# EAGLE design OPENKAYO-v1_1 (EAGLE 9.7.0)

## Sheet 1 of 3
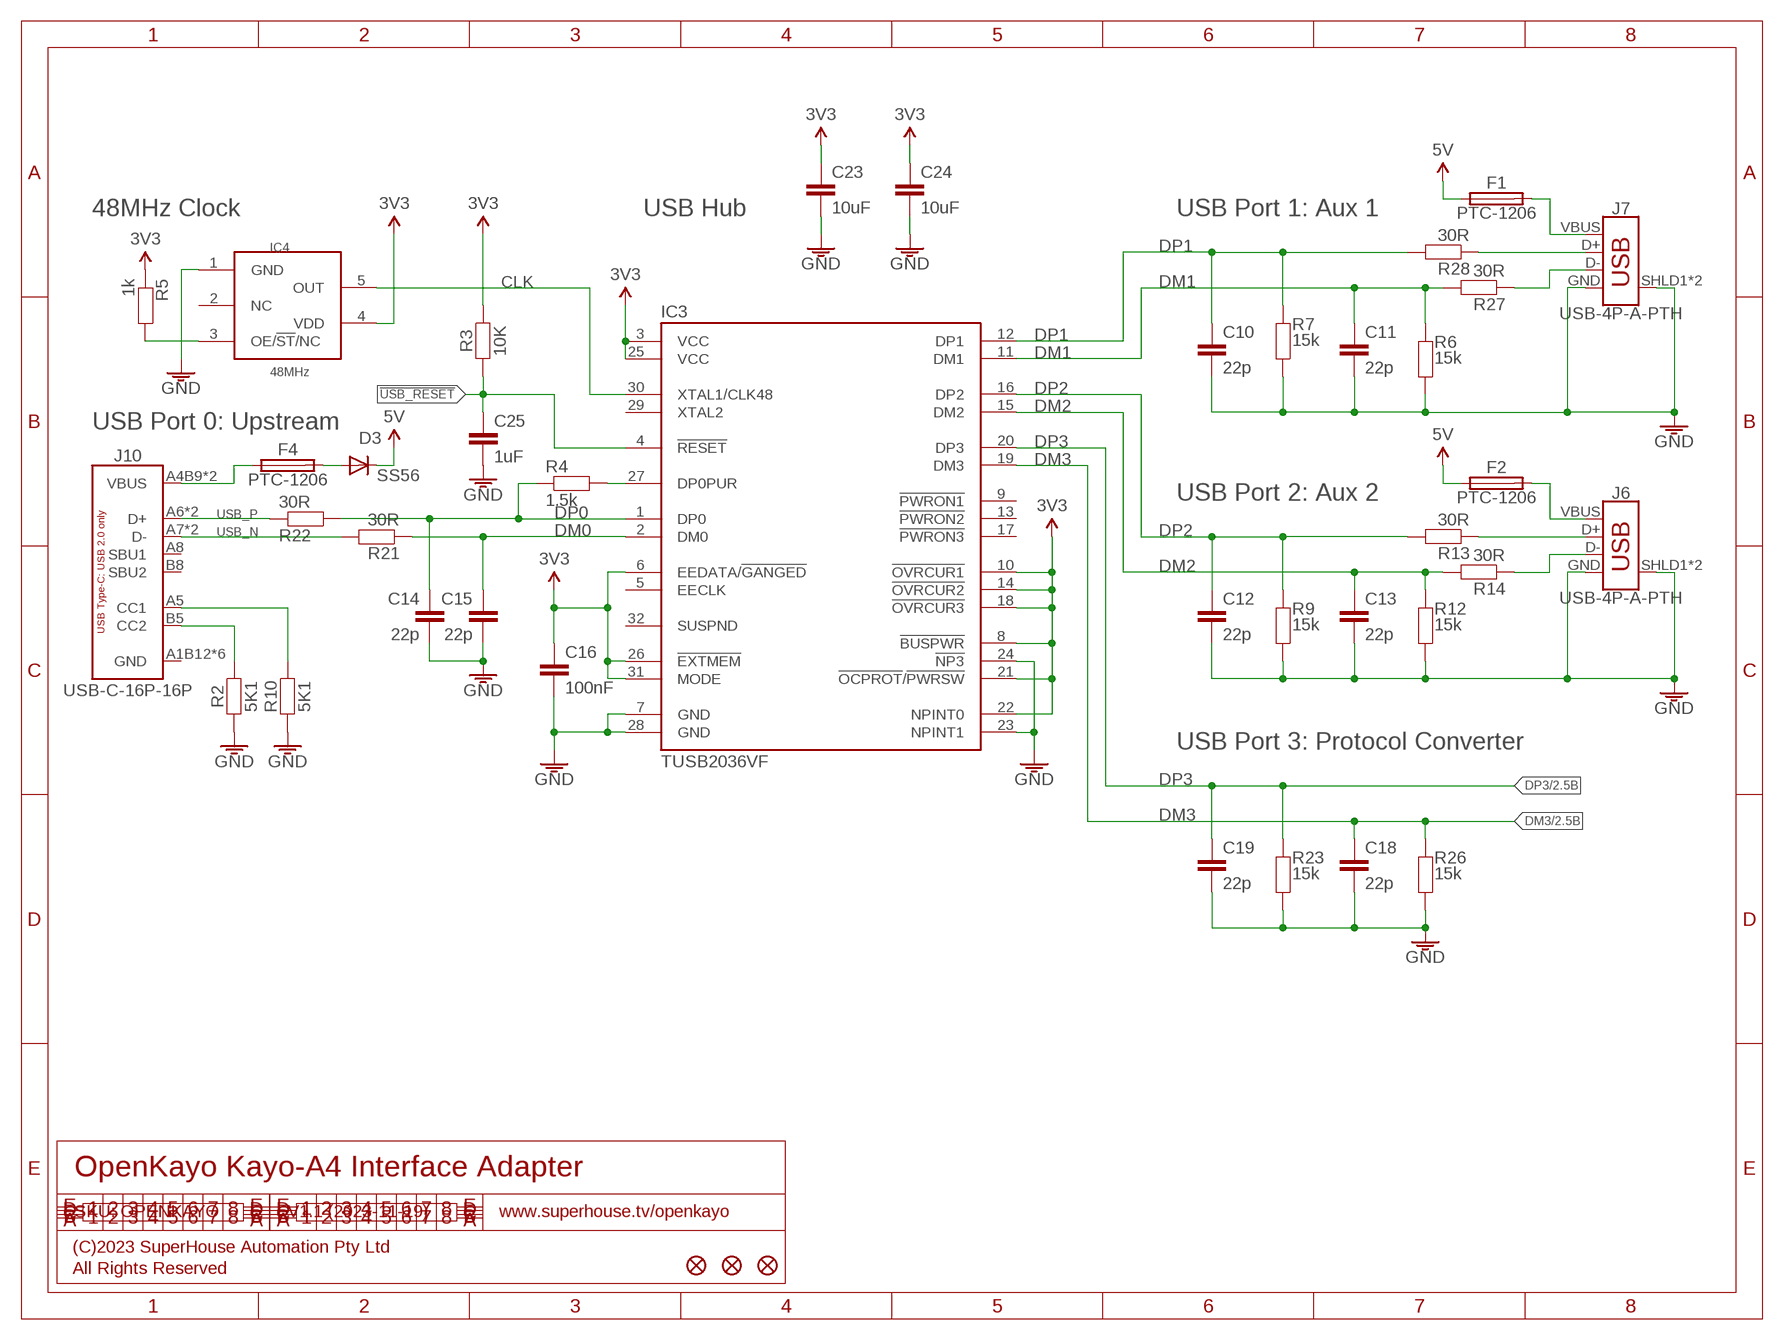
[diagram p0: schematic, sheet 1]

### Parts
C10  22p  CAP0603  [C0603]
C11  22p  CAP0603  [C0603]
C12  22p  CAP0603  [C0603]
C13  22p  CAP0603  [C0603]
C14  22p  CAP0603  [C0603]
C15  22p  CAP0603  [C0603]
C16  100nF  CAP0603  [C0603]
C18  22p  CAP0603  [C0603]
C19  22p  CAP0603  [C0603]
C23  10uF  CAP0805  [C0805]
C24  10uF  CAP0805  [C0805]
C25  1uF  CAP0603  [C0603]
D3  SS56  DIODESMA  [SMA-DIODE]
F1  PTC-1206  [1206]
F2  PTC-1206  [1206]
F4  PTC-1206  [1206]
FID1  FIDUCIAL1X2.5  [FIDUCIAL-1X2.5]
FID2  FIDUCIAL1X2.5  [FIDUCIAL-1X2.5]
FID3  FIDUCIAL1X2.5  [FIDUCIAL-1X2.5]
IC3  TUSB2036VF  [PQFP-G32]
IC4  48MHz  SIT2001BSOT-23-5  [SOT-23-5]
J6  USB-4P-A-PTH  [USB-A-PTH]
J7  USB-4P-A-PTH  [USB-A-PTH]
J10  USB-C-16P-16P  [USB-C-16P]
R2  5K1  RESISTOR0603  [R0603]
R3  10K  RESISTOR0603  [R0603]
R4  1.5k  RESISTOR0603  [R0603]
R5  1k  RESISTOR0603  [R0603]
R6  15k  RESISTOR0603  [R0603]
R7  15k  RESISTOR0603  [R0603]
R9  15k  RESISTOR0603  [R0603]
R10  5K1  RESISTOR0603  [R0603]
R12  15k  RESISTOR0603  [R0603]
R13  30R  RESISTOR0603  [R0603]
R14  30R  RESISTOR0603  [R0603]
R21  30R  RESISTOR0603  [R0603]
R22  30R  RESISTOR0603  [R0603]
R23  15k  RESISTOR0603  [R0603]
R26  15k  RESISTOR0603  [R0603]
R27  30R  RESISTOR0603  [R0603]
R28  30R  RESISTOR0603  [R0603]

### Nets
3.3V: C16.1 C23.1 C24.1 IC3.3(VCC) IC3.6(EEDATA/!GANGED) IC3.8(!BUSPWR) IC3.10(!OVRCUR1) IC3.14(!OVRCUR2) IC3.18(!OVRCUR3) IC3.21(!OCPROT!/!PWRSW!) IC3.22(NPINT0) IC3.25(VCC) IC3.26(!EXTMEM) IC3.31(MODE) IC4.4(VDD) R3.2 R5.1 ; also sheet 2,3
5V: D3.C F1.1 F2.1 ; also sheet 2,3
!USB_RESET: C25.1 IC3.4(!RESET) R3.1
CLK: IC3.30(XTAL1/CLK48) IC4.5(OUT)
DM0: C15.1 IC3.2(DM0) R21.2
DM1: C11.1 IC3.11(DM1) R6.1 R27.2
DM2: C13.1 IC3.15(DM2) R12.1 R14.2
DM3: C18.1 IC3.19(DM3) R26.1 ; also sheet 2
DP0: C14.1 IC3.1(DP0) R4.1 R22.2
DP1: C10.1 IC3.12(DP1) R7.1 R28.2
DP2: C12.1 IC3.16(DP2) R9.1 R13.2
DP3: C19.1 IC3.20(DP3) R23.1 ; also sheet 2
GND: C10.2 C11.2 C12.2 C13.2 C14.2 C15.2 C16.2 C18.2 C19.2 C23.2 C24.2 C25.2 IC3.7(GND) IC3.23(NPINT1) IC3.24(!NP3) IC3.28(GND) IC4.1(GND) J6.GND J6.SHLD1(SHIELD) J6.SHLD2(SHIELD) J7.GND J7.SHLD1(SHIELD) J7.SHLD2(SHIELD) R2.1 R6.2 R7.2 R9.2 R10.1 R12.2 R23.2 R26.2 ; also sheet 2,3
N$1: IC3.27(DP0PUR) R4.2
N$2: IC4.3(OE/!ST!/NC) R5.2
N$5: F1.2 J7.VBUS
N$6: F2.2 J6.VBUS
N$7: J10.B5(CC2) R2.2
N$12: J10.A5(CC1) R10.2
N$14: J6.D+ R13.1
N$15: J6.D- R14.1
N$16: J7.D+ R28.1
N$17: J7.D- R27.1
N$22: F4.1 J10.A4B9(VBUS) J10.A9B4(VBUS)
N$24: D3.A F4.2
USB_N: J10.A7(D-) J10.B7(D-) R21.1
USB_P: J10.A6(D+) J10.B6(D+) R22.1
Unconnected: IC3.5(EECLK) IC3.9(!PWRON1) IC3.13(!PWRON2) IC3.17(!PWRON3) IC3.29(XTAL2) IC3.32(SUSPND) IC4.2(NC) J10.A8(SBU1) J10.B8(SBU2)

### Notes on the sheet
- 48MHz Clock | USB Hub | USB Port 1: Aux 1
- USB Port 0: Upstream
- USB Port 2: Aux 2
- USB Port 3: Protocol Converter
- OpenKayo Kayo-A4 Interface Adapter
- SKU: OPENKAYO | V1.1 (2023-11-19) | www.superhouse.tv/openkayo
- (C)2023 SuperHouse Automation Pty Ltd
- All Rights Reserved

## Sheet 2 of 3
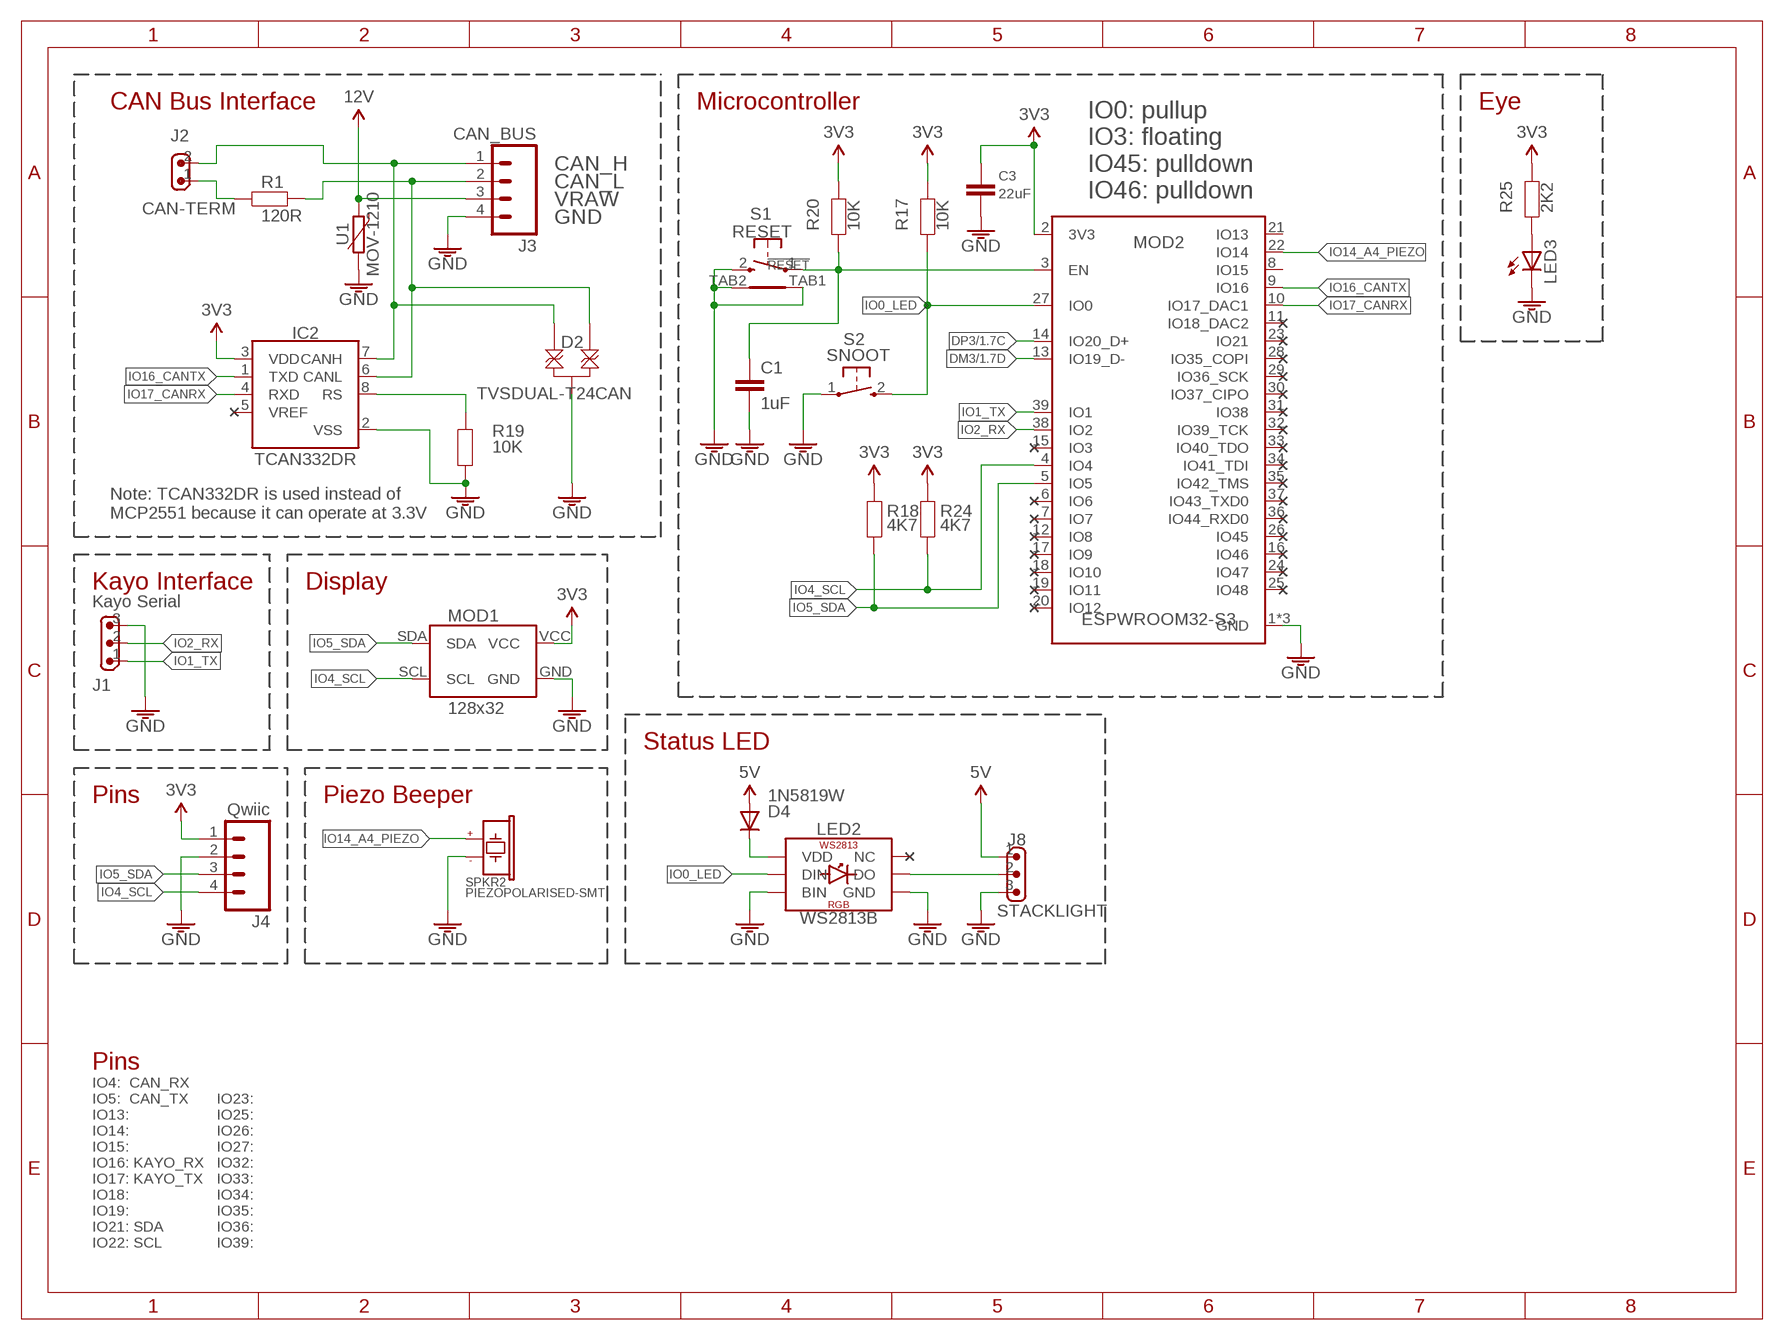
[diagram p1: schematic, sheet 2]

### Parts
C1  1uF  CAP0603  [C0603]
C3  22uF  CAP0805  [C0805]
D2  TVSDUAL-T24CAN  [SOT23-3]
D4  1N5819W  DIODE-SOD123  [SOD-123]
IC2  TCAN332DR  MCP2551-SOIC8  [SOIC8]
J1  Kayo Serial  M03-SCREW-3.81MM-HOR  [SCREWTERMINAL-3.81MM-HOR-3]
J2  CAN-TERM  M02-PIN-JUMP-Y  [1X02-P-JUMP-Y]
J3  CAN_BUS  M04-SCREW-3.81MM-HOR-PLUG  [SCREWTERMINAL-3.81MM-HOR-4]
J4  Qwiic  M04-SM4B-SH  [JST-SM4B-SH]
J8  STACKLIGHT  M03-PLAIN  [1X03]
LED2  WS2813B  WS2813-5050  [WS2813]
LED3  LED0603  [LED-0603]
MOD1  128x32  OLED-I2C-128X32-0.91-HEADER  [OLED-128X32-0.91-HEADER]
MOD2  ESPWROOM32-S3  [ESPWROOM32-S3]
R1  120R  RESISTOR2010  [R2010]
R17  10K  RESISTOR0603  [R0603]
R18  4K7  RESISTOR0603  [R0603]
R19  10K  RESISTOR0603  [R0603]
R20  10K  RESISTOR0603  [R0603]
R24  4K7  RESISTOR0603  [R0603]
R25  2K2  RESISTOR0603  [R0603]
S1  RESET  TAC-SWITCH-2PIN-GND-FSMRAJ  [TYCO-FSMRAJ]
S2  SNOOT  TAC_SWITCH_2PINSMT  [TACTILE_SMT_3X4X2]
SPKR2  PIEZOPOLARISED-SMT  [PIEZO-9.6X9.6-SMT]
U1  MOV-1210  [1210]

### Nets
3.3V: C3.1 IC2.3(VDD) J4.1 MOD1.VCC MOD2.2(3V3) R17.1 R18.1 R20.1 R24.1 R25.1 ; also sheet 1,3
5V: D4.2(A) J8.1 ; also sheet 1,3
12V: J3.3 U1.2 ; also sheet 3
!RESET: C1.1 MOD2.3(EN) R20.2 S1.1
CAN_H: D2.2 IC2.7(CANH) J2.2 J3.1
CAN_L: D2.1 IC2.6(CANL) J3.2 R1.2
DM3: MOD2.13(IO19_D-) ; also sheet 1
DP3: MOD2.14(IO20_D+) ; also sheet 1
GND: C1.2 C3.2 D2.3 IC2.2(VSS) J1.3 J3.4 J4.2 J8.3 LED2.5(GND) LED2.6(BIN) LED3.C MOD1.GND MOD2.1(GND) MOD2.40(GND) MOD2.41(GND) R19.1 S1.2 S1.TAB1 S1.TAB2 S2.1(P) SPKR2.2(-) U1.1 ; also sheet 1,3
IO0_LED: LED2.4(DIN) MOD2.27(IO0) R17.2 S2.2(S)
IO1_TX: J1.1 MOD2.39(IO1)
IO2_RX: J1.2 MOD2.38(IO2)
IO4_SCL: J4.4 MOD1.SCL MOD2.4(IO4) R24.2
IO5_SDA: J4.3 MOD1.SDA MOD2.5(IO5) R18.2
IO14_A4_PIEZO: MOD2.22(IO14) SPKR2.1(+)
IO16_CANTX: IC2.1(TXD) MOD2.9(IO16)
IO17_CANRX: IC2.4(RXD) MOD2.10(IO17_DAC1)
N$4: IC2.8(RS) R19.2
N$8: LED3.A R25.2
N$9: J2.1 R1.1
N$25: D4.1(C) LED2.2(VDD)
N$27: J8.2 LED2.3(DO)
Unconnected: IC2.5(VREF) MOD2.6(IO6) MOD2.7(IO7) MOD2.8(IO15) MOD2.11(IO18_DAC2) MOD2.12(IO8) MOD2.15(IO3) MOD2.17(IO9) MOD2.18(IO10) MOD2.19(IO11) MOD2.20(IO12) MOD2.21(IO13) MOD2.23(IO21) MOD2.24(IO47) MOD2.25(IO48) MOD2.26(IO45) MOD2.28(IO35_COPI) MOD2.29(IO36_SCK) MOD2.30(IO37_CIPO) MOD2.31(IO38) MOD2.32(IO39_TCK) MOD2.33(IO40_TDO) MOD2.34(IO41_TDI) MOD2.35(IO42_TMS) MOD2.36(IO44_RXD0) MOD2.37(IO43_TXD0)

### Notes on the sheet
- CAN Bus Interface | Microcontroller | Eye
- CAN_H
- CAN_L
- VRAW
- IO0: pullup
  IO3: floating
  IO45: pulldown
  IO46: pulldown
- GND
- Note: TCAN332DR is used instead of
  MCP2551 because it can operate at 3.3V
- Kayo Interface | Display
- Status LED
- Pins | Piezo Beeper
- Pins
- IO4:  CAN_RX
  IO5:  CAN_TX
  IO13: 
  IO14: 
  IO15: 
  IO16: KAYO_RX
  IO17: KAYO_TX
  IO18: 
  IO19: 
  IO21: SDA
  IO22: SCL
- IO23: 
  IO25: 
  IO26: 
  IO27: 
  IO32: 
  IO33: 
  IO34:
  IO35:
  IO36: 
  IO39:

## Sheet 3 of 3
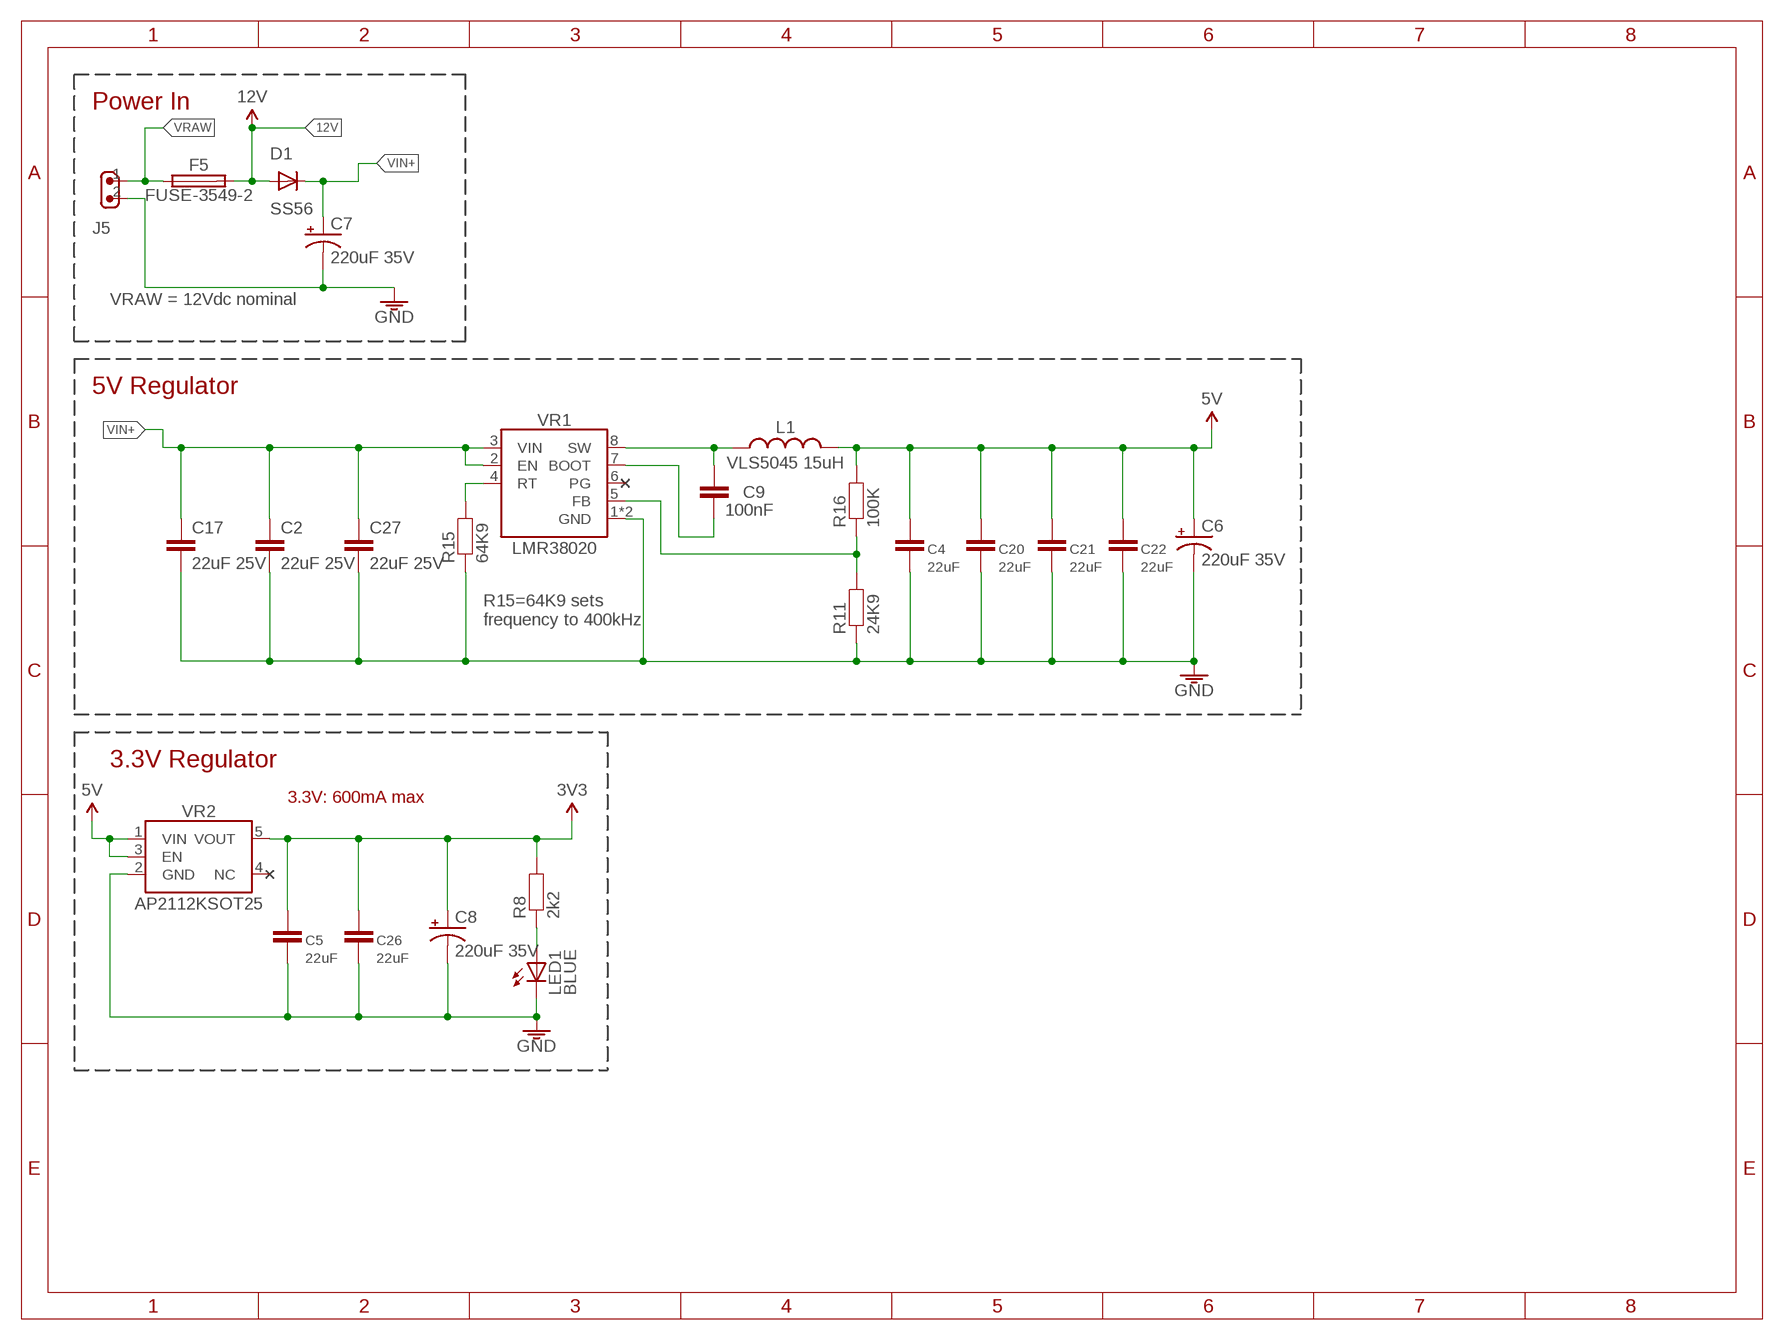
[diagram p2: schematic, sheet 3]

### Parts
C2  22uF 25V  CAP0805  [C0805]
C4  22uF  CAP0805  [C0805]
C5  22uF  CAP0805  [C0805]
C6  220uF 35V  CAP_POLG  [PANASONIC_G]
C7  220uF 35V  CAP_POLG  [PANASONIC_G]
C8  220uF 35V  CAP_POLG  [PANASONIC_G]
C9  100nF  CAP0603  [C0603]
C17  22uF 25V  CAP0805  [C0805]
C20  22uF  CAP0805  [C0805]
C21  22uF  CAP0805  [C0805]
C22  22uF  CAP0805  [C0805]
C26  22uF  CAP0805  [C0805]
C27  22uF 25V  CAP0805  [C0805]
D1  SS56  DIODESMA  [SMA-DIODE]
F5  FUSE-3549-2  [KS-3549-2]
J5  M02-SCREW-3.81MM-HOR  [SCREWTERMINAL-3.81MM-HOR-2]
L1  VLS5045 15uH  INDUCTOR-5045  [INDUCTOR-5045]
LED1  BLUE  LED0603  [LED-0603]
R8  2k2  RESISTOR0603  [R0603]
R11  24K9  RESISTOR0603  [R0603]
R15  64K9  RESISTOR0603  [R0603]
R16  100K  RESISTOR0603  [R0603]
VR1  LMR38020  LMR38010  [HSOIC8]
VR2  AP2112KSOT25  [SOT23-5]

### Nets
3.3V: C5.1 C8.+ C26.1 R8.2 VR2.5(VOUT) ; also sheet 1,2
5V: C4.1 C6.+ C20.1 C21.1 C22.1 L1.2 R16.2 VR2.1(VIN) VR2.3(EN) ; also sheet 1,2
12V: D1.A F5.3 F5.4 ; also sheet 2
GND: C2.2 C4.2 C5.2 C6.- C7.- C8.- C17.2 C20.2 C21.2 C22.2 C26.2 C27.2 J5.2 LED1.C R11.1 R15.1 VR1.1(GND) VR1.TGND(GND) VR2.2(GND) ; also sheet 1,2
N$3: C9.1 L1.1 VR1.8(SW)
N$13: R15.2 VR1.4(RT)
N$18: R11.2 R16.1 VR1.5(FB)
N$19: C9.2 VR1.7(BOOT)
N$23: LED1.A R8.1
VIN+: C2.1 C7.+ C17.1 C27.1 D1.C VR1.2(EN) VR1.3(VIN)
VRAW: F5.1 F5.2 J5.1
Unconnected: VR2.4(NC)

### Notes on the sheet
- Power In
- VRAW = 12Vdc nominal
- 5V Regulator
- R15=64K9 sets
  frequency to 400kHz
- 3.3V Regulator
- 3.3V: 600mA max

## Power pins joined to a net without a drawn wire
GND: J10.A1B12(GND) J10.A12B1(GND) J10.FIX1(GND) J10.FIX2(GND) J10.FIX3(GND) J10.FIX4(GND)
IO46: MOD2.16(IO46)
NC: LED2.1(NC)
PG: VR1.6(PG)

## Library data of the parts
C1-C5 C9-C13 C17-C24 C26 C27 = SuperHouse-Capacitors:CAP: Capacitor Standard ceramic capacitor
C6-C8 = SuperHouse-Capacitors:CAP_POL: Capacitor Polarized These are standard SMD and PTH capacitors. Normally 10uF, 47uF, and 100uF in electrolytic and tantalum varieties. Always verify the external diameter of the through hole cap, it varies with capacity, voltage, and manufacturer. The EIA devices should be standard.
C14-C16 C25 = SuperHouse-DiscreteSemi:CAP: Capacitor Standard ceramic capacitor
D1 D3 D4 = SuperHouse-Diodes:DIODE: Diode Standard reverse protection diodes and small signal diodes. SMA package can handle up to about 1A. SOD-323 can handle about 200mA.
D2 = SuperHouse-Diodes:TVSDUAL: Transient Voltage Suppressor (dual)
F1 F2 F4 = SuperHouse-Fuses:PTC: Resettable polyfuses
F5 = SuperHouse-Fuses:FUSE: Fuse
FID1-FID3 = SuperHouse-Symbols:FIDUCIAL: Fiducial Alignment Points Various fiducial points for machine vision alignment.
IC2 = SuperHouse-ICs:MCP2551: CAN bus transceiver. Pin compatible chips with different specs include: MCP2551 (5V only) TCAN332DR (3.3V)
IC3 = SuperHouse-ICs:TUSB2036VF: 2/3 port Hub for the Universal serial bus with optional serial EEPROM Interface
IC4 = my library:SIT2001B
J1 J8 = SuperHouse-Connectors:M03: 3-way header Standard 1x3 header, and screw terminal variations
J2 J5 = SuperHouse-Connectors:M02: 2-way header Standard 1x2 header, and screw terminal variations
J3 J4 = SuperHouse-Connectors:M04: 4-way header Standard 1x4 header, and screw terminal variations
J6 J7 = SuperHouse-Connectors:USB-4P: USB Type B Connector
J10 = SuperHouse-Connectors:USB-C-16P: USB-C socket with 16 pins, suitable only for backward compatibility with USB 2
L1 = SuperHouse-Inductors:INDUCTOR: INDUCTOR, American symbol
LED1 LED3 = SuperHouse-LEDs:LED: LEDs in various sizes including 5mm and 3mm PTH, and 0402, 0603, 0805, etc SMT
LED2 = SuperHouse-LEDs:WS2813
MOD1 = SuperHouse-Displays:OLED-I2C: OLED module with SSD1306 I2C driver
MOD2 = SuperHouse-MCUs:ESPWROOM32-S3
R1-R3 R8 R10 R11 R15-R20 R24 R25 = SuperHouse-Resistors:RESISTOR: Resistors in both surface-mount and through-hole versions.
R4-R7 R9 R12-R14 R21-R23 R26-R28 = SuperHouse-DiscreteSemi:RESISTOR: Resistor Standard resistors.
S1 = SuperHouse-Switches:TAC-SWITCH-2PIN-GND: Tactile switch (right angle) with 2 mounting tabs
S2 = SuperHouse-Switches:TAC_SWITCH_2PIN: Momentary Tactile Switch - 2 pin Uxcell 3x4x2mm switch with 2 SMT pads
SPKR2 = SuperHouse-Audio:PIEZOPOLARISED
U1 = SuperHouse-Fuses:MOV: MOV
VR1 = SuperHouse-Regulators:LMR38010
VR2 = SuperHouse-Regulators:AP2112K: AP2112K LDO linear voltage regulator

## Net classes
0 Default: width 0.203 mm
1 VCC: width 0.305 mm

## Board
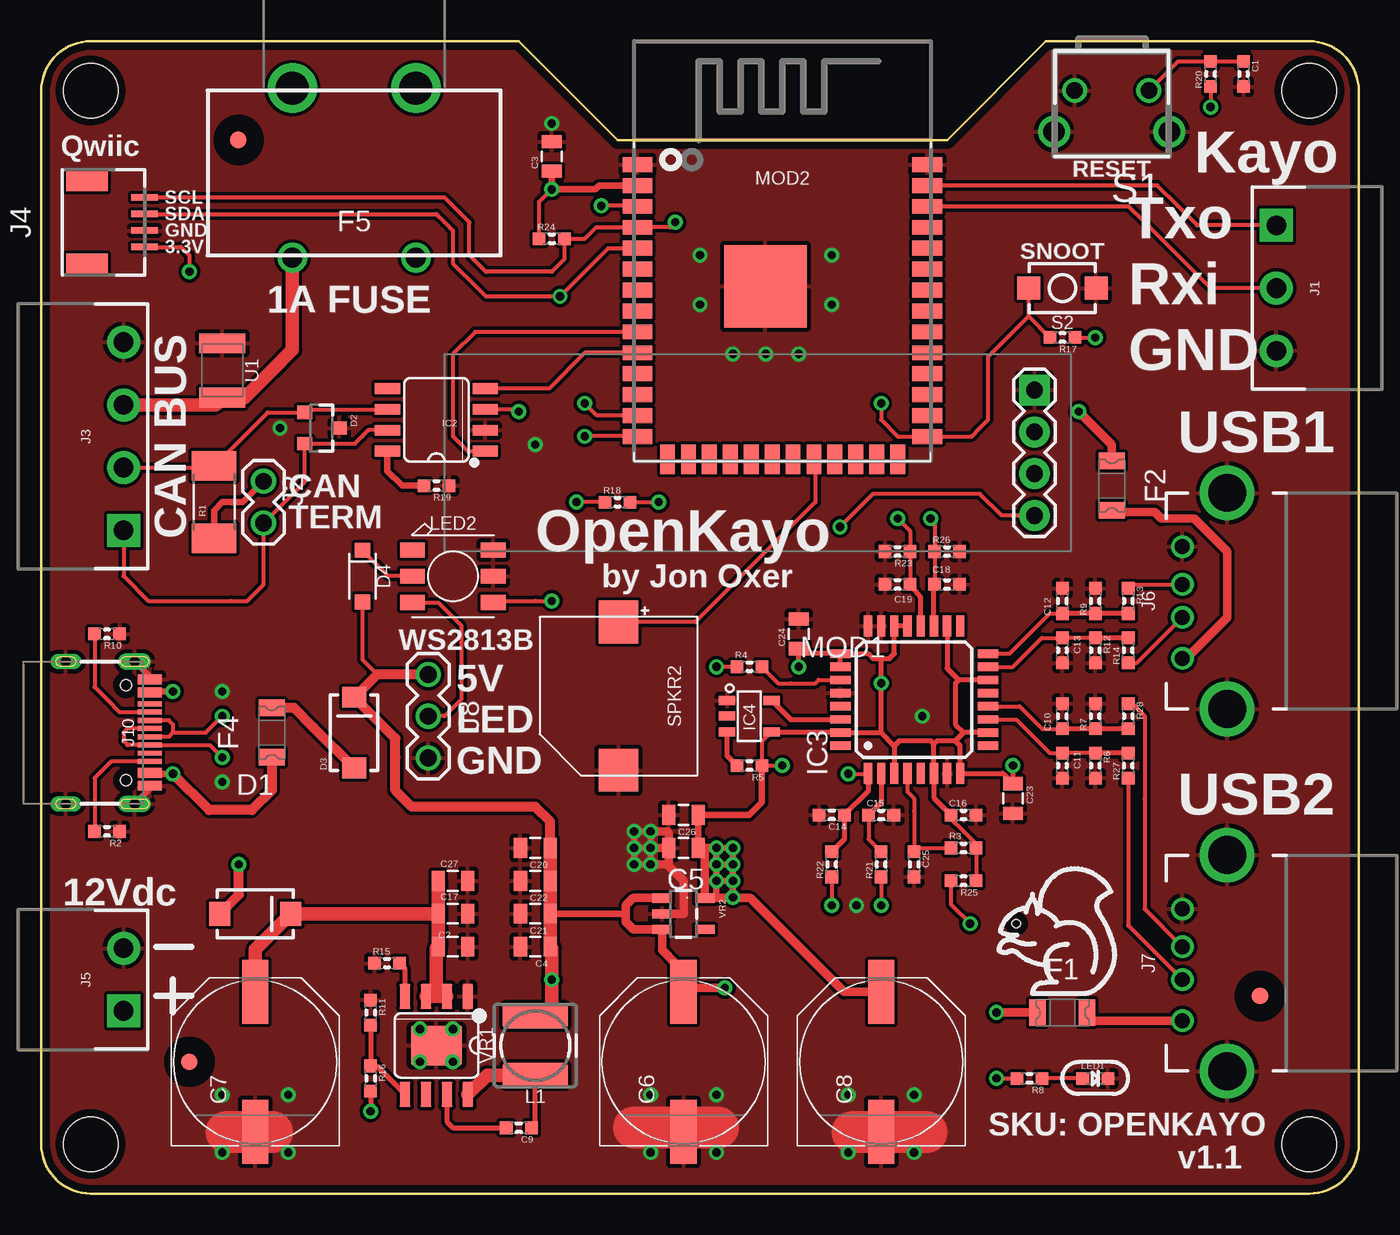
[diagram p3: board, top side]
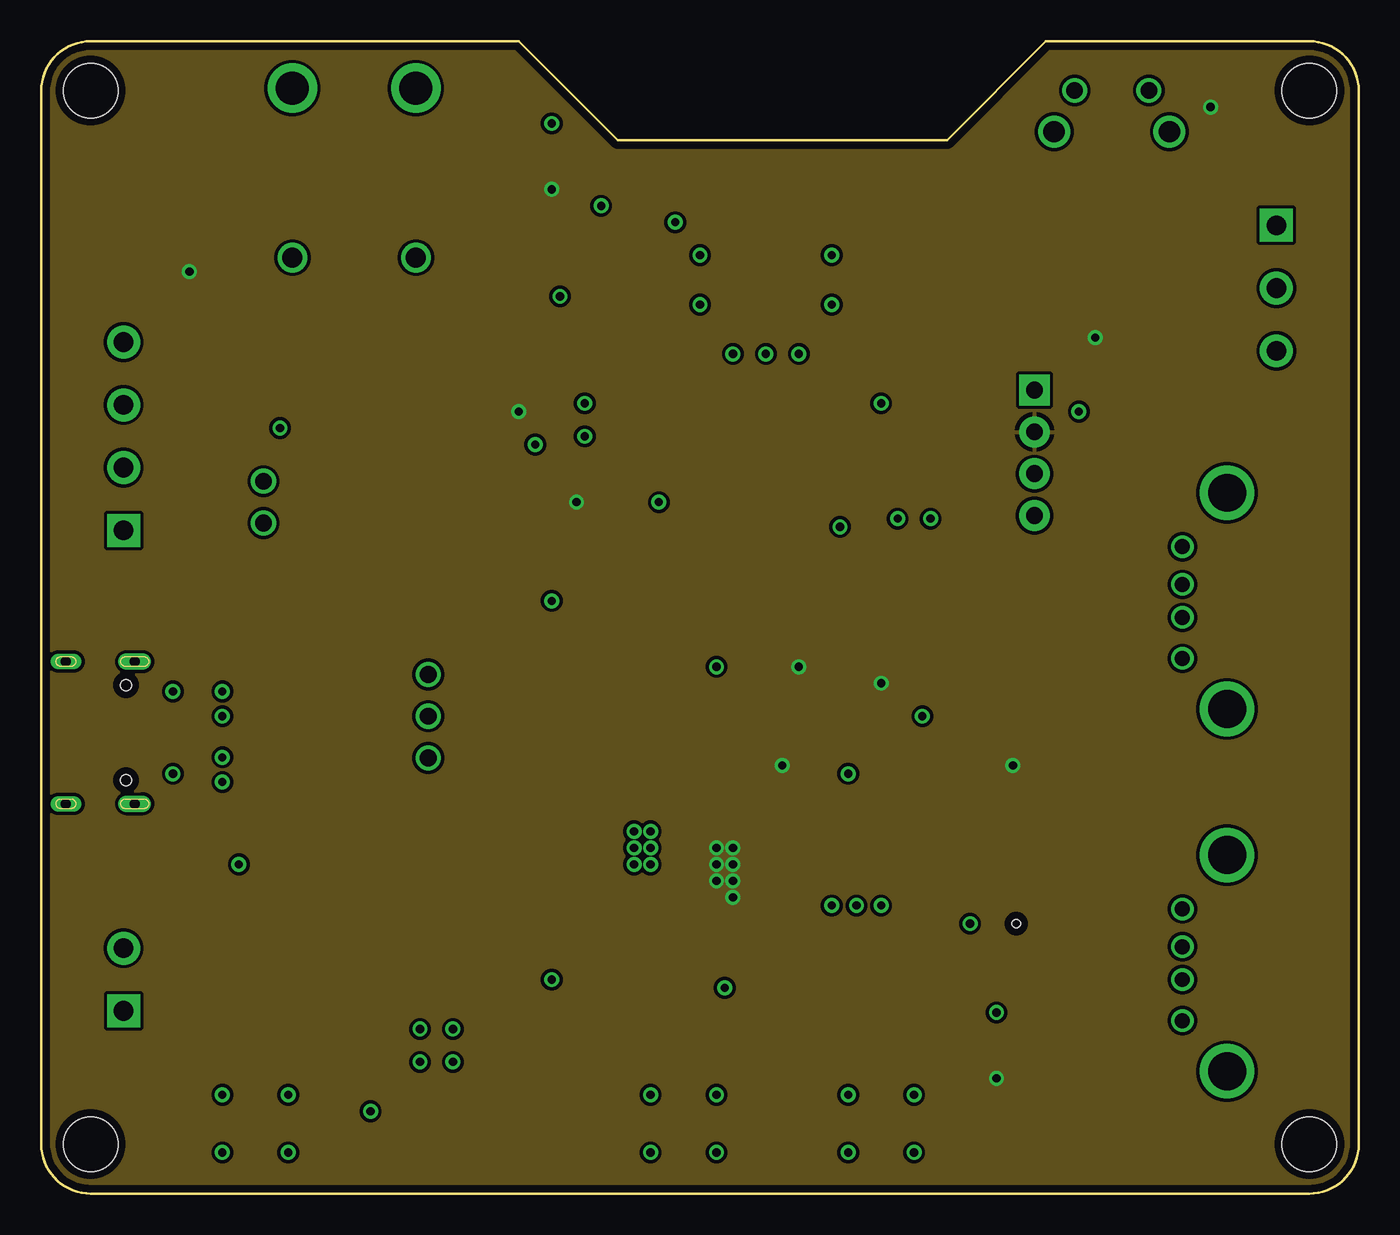
[diagram p4: board, inner layer Route2]
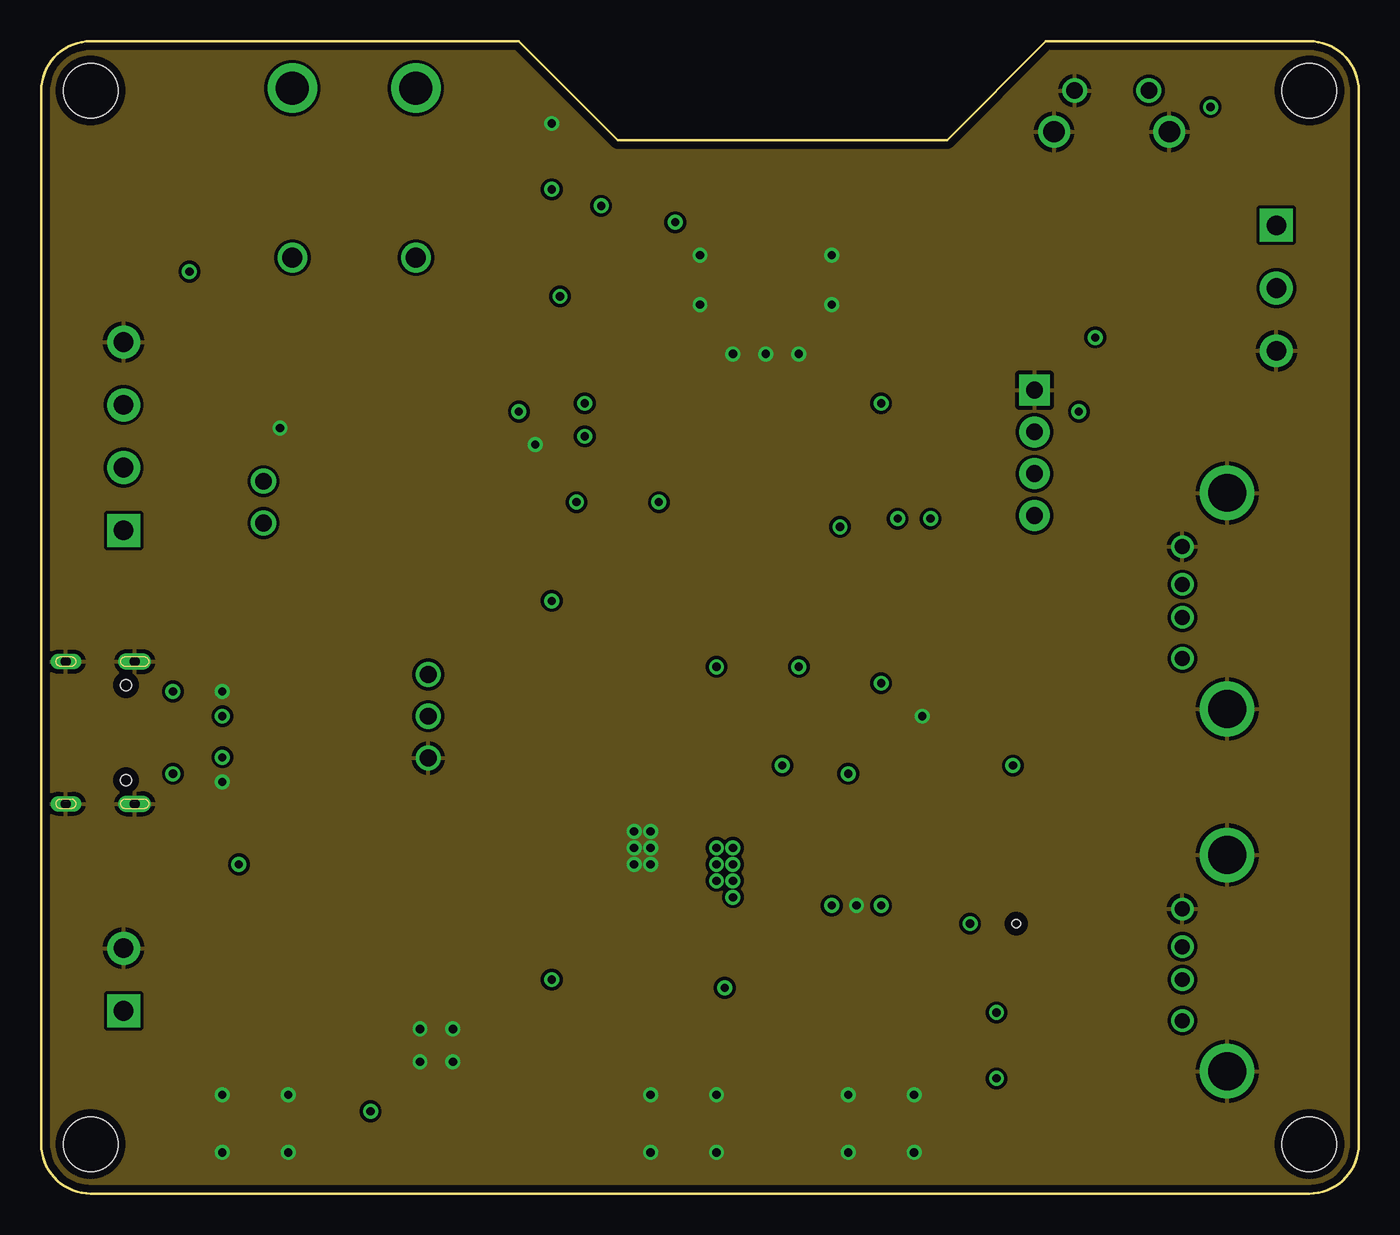
[diagram p5: board, inner layer Route15]
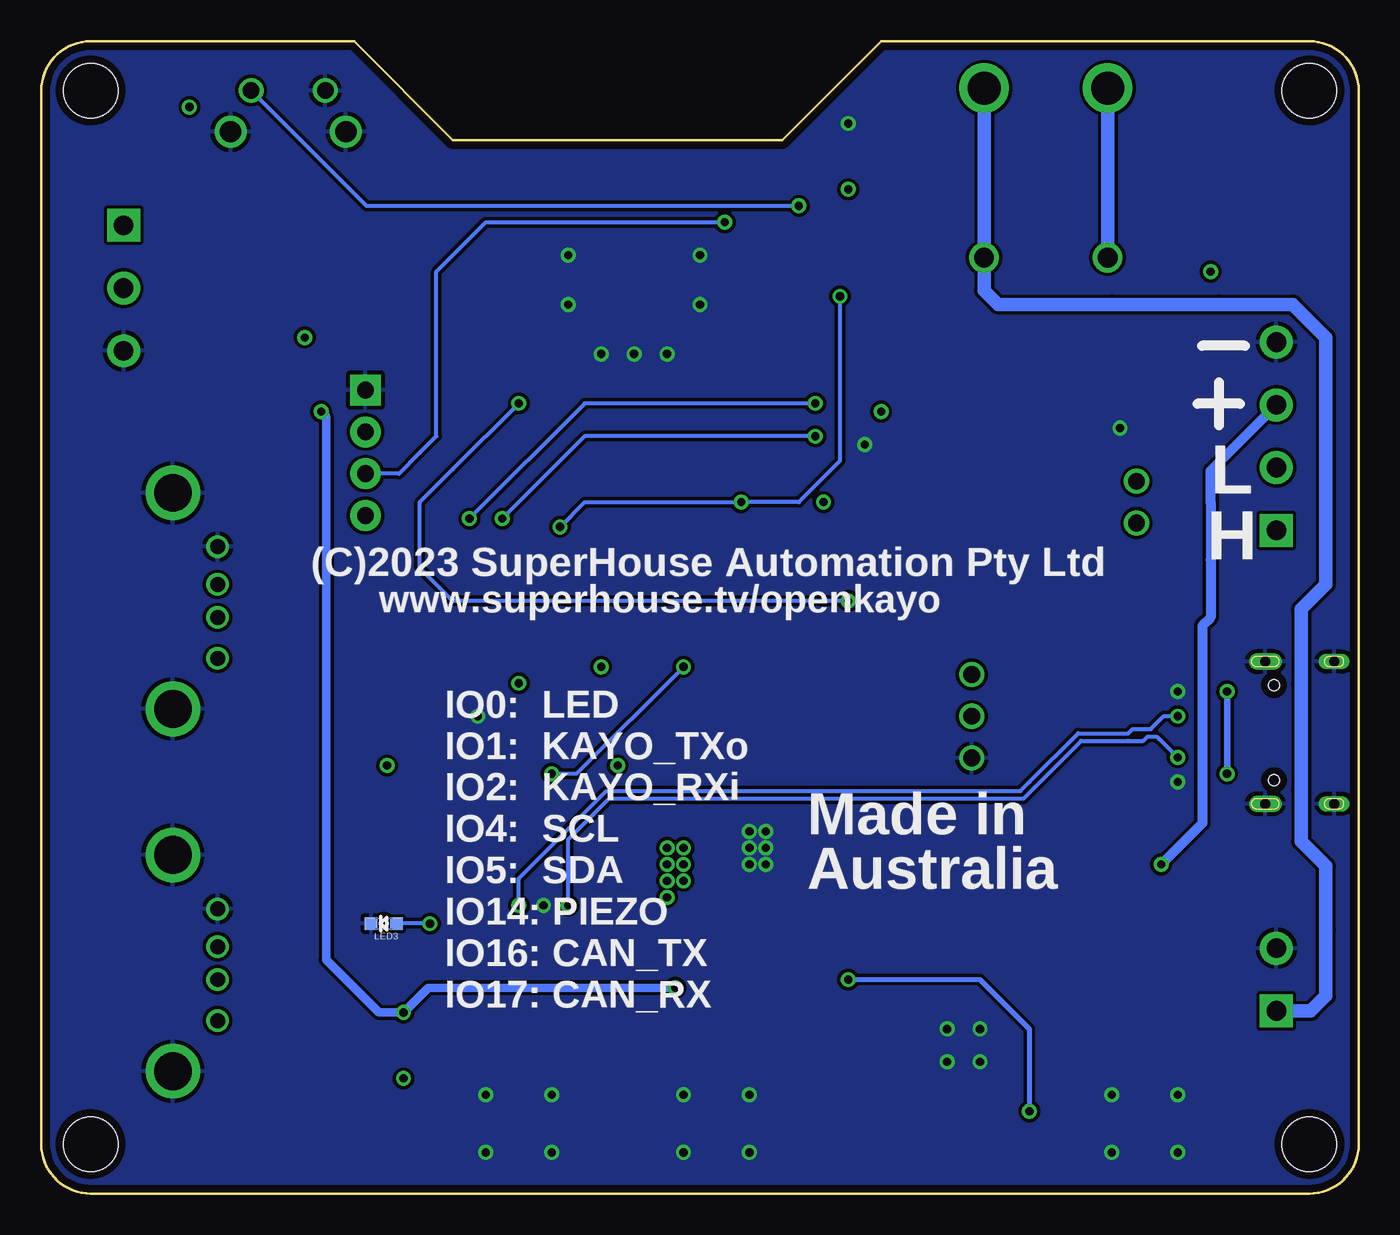
[diagram p6: board, bottom side, seen from below]

Size 80 x 70 mm. Coordinates in mm from the lower left corner, seen from the top.
Outline: 3,70 29,70 35,64 55,64 61,70 77,70 arc-90 80,67 80,3 arc-90 77,0 3,0 arc-90 0,3 0,67 arc-90 3,70
Copper layers (1+2*15+16): Top 0.035mm / dielectric 1.5mm / Route2 0.035mm / dielectric 0.15mm / Route15 0.035mm / dielectric 0.2mm / Bottom 0.035mm
Design rules "SuperHouse-Design-Rules *": minimum track width 10mil, minimum drill 24mil, track to track 8mil, track to pad 8mil, pad to pad 8mil, via to via 8mil, smd to smd 6mil, copper to edge 18mil, drill to drill 8mil, minimum pad ring 7mil, minimum via ring 8mil, stop-mask expansion 4mil, vias tented up to drill 0.5mm, thermal gap 10mil
Holes 3.3 mm at 77,3 77,67 3,3 3,67
Holes 0.5 mm at 59.2,16.4
tRestrict: area 73,11 to 75,13; area 8,7 to 10,9; area 11,63 to 13,65

### Footprints (pad centres in the part's own frame; a part is rotated, then mirrored left to right if it is on the bottom)
C0603 = smd 0.762 x 0.762: 1 -0.762,0; 2 0.762,0
C0805 = smd 0.8 x 1.2: 1 -0.9,0; 2 0.9,0
PANASONIC_G = smd 3.9 x 1.6: + 4.25,0; - -4.25,0
SMA-DIODE = smd 1.27 x 1.47: A -2.15,0; C 2.15,0
SOT23-3 = smd 0.8 x 0.9: 1 -0.95,-1; 2 0.95,-1; 3 0,1.1
SOD-123 = smd 0.9 x 0.95: 1 -1.575,0; 2 1.575,0
1206 = smd 1 x 1.6: 1 -1.5,0; 2 1.5,0
KS-3549-2 = drill 2: 1 -3.75,-5.15; 3 3.75,-5.15 | drill 1.2: 2 -3.75,5.15; 4 3.75,5.15
FIDUCIAL-1X2.5 = smd 1 x 1: 1 0,0
SOIC8 = smd 1.524 x 0.66: 1 -2.973,1.905; 2 -2.973,0.635; 3 -2.973,-0.635; 4 -2.973,-1.905; 5 2.973,-1.905; 6 2.973,-0.635; 7 2.973,0.635; 8 2.973,1.905
PQFP-G32 = smd 1.25 x 0.5: 1 -4.475,2.8; 2 -4.475,2; 3 -4.475,1.2; 4 -4.475,0.4; 5 -4.475,-0.4; 6 -4.475,-1.2; 7 -4.475,-2; 8 -4.475,-2.8; 17 4.475,-2.8; 18 4.475,-2; 19 4.475,-1.2; 20 4.475,-0.4; 21 4.475,0.4; 22 4.475,1.2; 23 4.475,2; 24 4.475,2.8 | smd 0.5 x 1.25: 9 -2.8,-4.475; 10 -2,-4.475; 11 -1.2,-4.475; 12 -0.4,-4.475; 13 0.4,-4.475; 14 1.2,-4.475; 15 2,-4.475; 16 2.8,-4.475; 25 2.8,4.475; 26 2,4.475; 27 1.2,4.475; 28 0.4,4.475; 29 -0.4,4.475; 30 -1.2,4.475; 31 -2,4.475; 32 -2.8,4.475
SOT-23-5 = smd 1 x 0.55: 1 -1.35,0.95; 2 -1.35,0; 3 -1.35,-0.95; 4 1.35,-0.95; 5 1.35,0.95
SCREWTERMINAL-3.81MM-HOR-3 = drill 1.2 pad 2 square: 1 -3.813,0 | drill 1.2 pad 2: 2 0,0; 3 3.81,0
1X02-P-JUMP-Y = drill 1.016: 1 -1.27,0; 2 1.27,0
SCREWTERMINAL-3.81MM-HOR-4 = drill 1.2 pad 2 square: 1 -5.715,0 | drill 1.2 pad 2: 2 -1.902,0; 3 1.908,0; 4 5.718,0
JST-SM4B-SH = smd 0.4 x 1.6: 1 -1.5,0; 2 -0.5,0; 3 0.5,0; 4 1.5,0 | smd 1.2 x 2.5: GND@1 -2.5,3.5; GND@2 2.5,3.5
SCREWTERMINAL-3.81MM-HOR-2 = drill 1.2 pad 2 square: 1 -1.905,0 | drill 1.2 pad 2: 2 1.908,0
USB-A-PTH = drill 0.91: D+ 1,2.71; D- -1,2.71; GND 3.29,2.71; VBUS -3.49,2.71 | drill 2.3: SHLD1 6.565,0; SHLD2 -6.565,0
1X03 = drill 1.016: 1 -2.54,0; 2 0,0; 3 2.54,0
USB-C-16P = smd 0.6 x 1.45: A1B12 -3.225,5.095; A4B9 -2.45,5.095; A9B4 2.45,5.095; A12B1 3.225,5.095 | smd 0.3 x 1.45: A5 -1.25,5.095; A6 -0.25,5.095; A7 0.25,5.095; A8 1.25,5.095; B5 1.75,5.095; B6 0.75,5.095; B7 -0.75,5.095; B8 -1.75,5.095 | drill 0.6 pad 0.8 long: FIX1 -4.32,0; FIX4 4.32,0 | drill 0.6 pad 1 long: FIX2 -4.32,4.18; FIX3 4.32,4.18 | hole 0.65: 2.89,3.65; -2.89,3.65
INDUCTOR-5045 = smd 4 x 1.5: 1 0,1.8; 2 0,-1.8
LED-0603 = smd 0.762 x 0.762: A -0.762,0; C 0.762,0
WS2813 = smd 1.5 x 0.9: 1 -2.45,1.6; 2 -2.45,0; 3 -2.45,-1.6; 4 2.45,-1.6; 5 2.45,0; 6 2.45,1.6
OLED-128X32-0.91-HEADER = drill 1.016 pad 1.88 square: GND -18.31,-3.81 | drill 1.016 pad 1.88: SCL -18.31,1.27; SDA -18.31,3.81; VCC -18.31,-1.27
ESPWROOM32-S3 = smd 1.8 x 0.9: 1 -8.8,-1.5; 2 -8.8,-2.77; 3 -8.8,-4.04; 4 -8.8,-5.31; 5 -8.8,-6.58; 6 -8.8,-7.85; 7 -8.8,-9.12; 8 -8.8,-10.39; 9 -8.8,-11.66; 10 -8.8,-12.93; 11 -8.8,-14.2; 12 -8.8,-15.47; 13 -8.8,-16.74; 14 -8.8,-18.01; 27 8.8,-18.01; 28 8.8,-16.74; 29 8.8,-15.47; 30 8.8,-14.2; 31 8.8,-12.93; 32 8.8,-11.66; 33 8.8,-10.39; 34 8.8,-9.12; 35 8.8,-7.85; 36 8.8,-6.58; 37 8.8,-5.31; 38 8.8,-4.04; 39 8.8,-2.77; 40 8.8,-1.5 | smd 0.9 x 1.8: 15 -6.97,-19.4; 16 -5.7,-19.4; 17 -4.43,-19.4; 18 -3.16,-19.4; 19 -1.89,-19.4; 20 -0.62,-19.4; 21 0.65,-19.4; 22 1.92,-19.4; 23 3.19,-19.4; 24 4.46,-19.4; 25 5.73,-19.4; 26 7,-19.4 | smd 5 x 5: 41 -1.03,-8.89
R2010 = smd 1.8 x 2.7: 1 -2.2,0; 2 2.2,0
R0603 = smd 0.762 x 0.762: 1 -0.762,0; 2 0.762,0
TYCO-FSMRAJ = drill 1: 1 -2.25,0; 2 2.25,0 | drill 1.3: TAB1 -3.5,2.5; TAB2 3.5,2.5
TACTILE_SMT_3X4X2 = smd 1.4 x 1.4: 1 -2.05,0; 2 2.05,0
PIEZO-9.6X9.6-SMT = smd 2.6 x 2.4: 1 -4.5,0; 2 4.5,0
1210 = smd 1.2 x 2.8: 1 -1.65,0; 2 1.65,0
HSOIC8 = smd 1.524 x 0.66: 1 -2.973,1.905; 2 -2.973,0.635; 3 -2.973,-0.635; 4 -2.973,-1.905; 5 2.973,-1.905; 6 2.973,-0.635; 7 2.973,0.635; 8 2.973,1.905 | smd 2.4 x 3.1: TGND 0,0
SOT23-5 = smd 0.55 x 1.2: 1 -0.95,-1.3; 2 0,-1.3; 3 0.95,-1.3; 4 0.95,1.3; 5 -0.95,1.3

### Placement (x,y rotation side)
C1  73,68 270 top
C2  25,15 0 top
C3  31,63 90 top
C4  30,15 180 top
C5  39,21 180 top
C6  39,8 90 top
C7  13,8 90 top
C8  51,8 90 top
C9  29,4 180 top
C10  62,29 90 top
C11  62,26 270 top
C12  62,36 90 top
C13  62,33 270 top
C14  48,23 180 top
C15  51,23 0 top
C16  56,23 0 top
C17  25,17 0 top
C18  55,37 0 top
C19  52,37 180 top
C20  30,21 180 top
C21  30,17 180 top
C22  30,19 180 top
C23  59,24 270 top
C24  46,34 90 top
C25  53,20 270 top
C26  39,23 180 top
C27  25,19 0 top
D1  13,17 0 top
D2  17,46.5 270 top
D3  19,28 90 top
D4  19.5,37.5 270 top
F1  62,11 0 top
F2  65,43 270 top
F4  14,28 90 top
F5  19,62 180 top
FID1  74,12 180 top
FID2  9,8 180 top
FID3  11.98,64 90 top
IC2  24,47 180 top
IC3  53,30 90 top
IC4  43,29 0 top
J1  75,55 270 top
J2  13.5,42 270 top
J3  5,46 90 top
J4  6.28,59 90 top
J5  5,13 90 top
J6  72,36 90 top
J7  72,14 90 top
J8  23.5,29 270 top
J10  1.5,28 270 top
L1  30,9 180 top
LED1  64,7 0 top
LED2  25,37.5 0 top
LED3  59.2,16.4 180 bottom
MOD1  42,45 180 top
MOD2  45,64 0 top
R1  10.5,42 90 top
R2  4,22 180 top
R3  56,21 0 top
R4  43,32 0 top
R5  43,26 180 top
R6  64,26 270 top
R7  64,29 90 top
R8  60,7 180 top
R9  64,36 90 top
R10  4,34 180 top
R11  20,11 270 top
R12  64,33 270 top
R13  66,36 270 top
R14  66,33 90 top
R15  21,14 0 top
R16  20,7 270 top
R17  62,52 180 top
R18  35,42 0 top
R19  24,43 180 top
R20  71,68 90 top
R21  51,20 90 top
R22  48,20 90 top
R23  52,39 180 top
R24  31,58 0 top
R25  56,19 180 top
R26  55,39 0 top
R27  66,26 90 top
R28  66,29 270 top
S1  65,67 180 top
S2  62,55 180 top
SPKR2  35.06,30.22 270 top
U1  11,50 270 top
VR1  24,9 270 top
VR2  39,17 270 top

### Tracks (layer width: path | path; a pad name or v marks a point on that pad's centre or on a via)
3.3V  (via drill 0.5)
  Top 0.254: R17.1 v64,52 | R24.1 30.24,60.24 v31,61 | R20.1 v71,66 | v45,26 R5.1 43.76,27.46 IC4.4 | v58,7 R8.2 | J4.1 8.5,57.5 9,57 v9,56 | v29,47.5 28.86,47.63 IC2.3 | R18.1 v32.5,42 | C16.1 55.24,22.76 56,22 56.76,21.24 R3.2 R25.1
  Top 0.305: IC3.21 IC3.22 51.8,32.8 51.5,32.5 51,32.5 | 51,32.5 50.5,32.5 50.2,32.8 IC3.25 | IC3.26 IC3.25 | 51,28 IC3.31 48.48,28.05 IC4.4 | 51.8,27.2 51,28 | 51.8,27.2 IC3.3 | 51,28 51,32.5 | 54.2,27.3 IC3.6 54.2,24.04 C16.1 | 54.2,27.3 54,27.5 52.1,27.5 51.8,27.2 | 55.5,27.5 55.8,27.2 IC3.8 58.38,25.52 C23.1 v59,26 | 55.5,27.5 54.4,27.5 54.2,27.3 | IC3.10 56,28 | 56,28 55.5,27.5 | IC3.14 55.7,31.2 | 55.7,31.2 55.5,31 55.5,28.5 56,28 | IC3.18 55,31.9 55.7,31.2 | IC3.25 46.3,32.8 C24.1 v46,32
  Top 0.406: 40.3,20.65 C5.1 C26.1 43,23 43.76,23.76 R5.1 | VR2.5 41,17.95 v41,19 | 41.95,17.95 v42,18 v42,19 | v42,19 v42,20 | v42,20 v42,21 v41,21 v41,20 | v42,20 v41,20 | v41,20 40.3,20 | v41,20 v41,19 | v41,19 v42,19 | v41,19 40.3,19 | MOD2.2 33.87,61.23 33.64,61 v31,61 C3.1
  Top 0.508: VR2.5 40.3,19 40.3,20 40.3,20.65 | 41,17.95 41.95,17.95 43.05,17.95 48.75,12.25 C8.+ | C5.1 v41,21
  other vias: 51,31
  pour Route2: 55.04,63.94 55.02,63.92 34.98,63.92 34.96,63.94 28.89,70 3,70 2.57,69.97 2.15,69.88 1.75,69.73 1.38,69.52 1.04,69.27 0.73,68.96 0.48,68.62 0.27,68.25 0.12,67.85 0.03,67.43 0,67 0,3 0.03,2.57 0.12,2.15 0.27,1.75 0.48,1.38 0.73,1.04 1.04,0.73 1.38,0.48 1.75,0.27 2.15,0.12 2.57,0.03 3,0 77,0 77.43,0.03 77.85,0.12 78.25,0.27 78.62,0.48 78.96,0.73 79.27,1.04 79.52,1.38 79.73,1.75 79.88,2.15 79.97,2.57 80,3 80,67 79.97,67.43 79.88,67.85 79.73,68.25 79.52,68.62 79.27,68.96 78.96,69.27 78.62,69.52 78.25,69.73 77.85,69.88 77.43,69.97 77,70 61.03,69.92
5V  (via drill 0.5)
  Top 0.254: D4.2 19.5,32.43 20.39,31.54
  Top 0.305: R16.2 v20,5
  Top 0.406: C21.1 35.5,17 | 38.5,14 39,13.5 C6.+ 39.25,12.5
  Top 0.508: v63,47.5 65,45.5 F2.1 | VR2.1 35.95,17.95 35.5,17.5 35.5,17 35.5,16.5 35.95,16.05 VR2.3 37.7,14.8 38.5,14 | 39.25,12.5 v41.5,12.5 | F1.1 v58,11
  Top 0.61: C20.1 30.9,22.6 30,23.5 23.5,23.5 22.5,23.5 21.5,24.5 21.5,26.5 21.5,27.65 D3.C 20.39,31.54 J8.1
  Top 0.813: L1.2 30.2,11 31,11 v31,13 31,14.9 C4.1 C21.1 C22.1 C20.1
  Bottom 0.305: v20,5 20,10 23,13 v31,13
  Bottom 0.508: v41.5,12.5 55,12.5 56.5,12.5 v58,11 59.5,11 62.71,14.21 62.71,47.21 v63,47.5
12V  (via drill 0.5)
  Top 0.61: D1.A 12,18.15 v12,20
  Top 0.813: J3.3 10.56,47.91 U1.2 12.35,48.35 14,50 15.25,51.25 F5.4
  Bottom 0.61: J3.3 9,43.91 9,42 9,38.5 9,35 9.5,34.5 9.5,24 9.5,22.5 v12,20
  Bottom 0.813: F5.3 F5.4
!RESET  (via drill 0.5)
  Top 0.254: MOD2.3 36.16,60 v34,60 | S1.1 69.01,68.76 R20.2 C1.1
  Bottom 0.254: S1.1 60.25,60 v34,60
!USB_RESET
  Top 0.254: IC3.4 52.6,24.4 53,24 53,23.24 C25.1 53.24,21 R3.1
CAN_H
  Top 0.254: IC2.7 19.86,46.37 19.5,46 19.05,45.55 D2.2 16,43.23 J2.2 13.5,37 12.5,36 11.5,36 6.5,36 5,37.5 J3.1
CAN_L
  Top 0.254: J3.2 10.4,44.1 R1.2 13.75,47.45 D2.1 16.18,47.63 IC2.6
CLK
  Top 0.305: IC4.5 45.5,28.8 IC3.30
DM0
  Top 0.254: R21.2 50.24,21.52 C15.1
  Top 0.305: IC3.2 51,23.76 C15.1
DM1
  Top 0.254: IC3.11 59.2,28.8 60,28 61.24,26.76 C11.1 R6.1
  Top 0.305: R27.2 R6.1
DM2
  Top 0.254: IC3.15 59,32 60,33 60.65,33.65 60.76,33.76 C13.1 R12.1
  Top 0.305: R14.2 R12.1
DM3  (via drill 0.5)
  Top 0.254: MOD2.13 33.74,47.26 v33,48 | v54,41 54.24,40.76 R26.1 54.24,36.89 54.2,36.85
  Top 0.305: IC3.19 54.2,36.85 C18.1
  Bottom 0.254: v33,48 47,48 v54,41
DP0  (via drill 0.5)
  Top 0.254: R4.1 v41,32 | v49,25.5 50.17,25.5 IC3.1
  Top 0.305: R22.2 48.76,21.52 C14.1 50.2,24.44 IC3.1
  Bottom 0.254: v41,32 47.5,25.5 v49,25.5
DP1
  Top 0.254: IC3.12 59.4,29.6 60,29 60.65,28.35 60.76,28.24 C10.1
  Top 0.305: R28.2 R7.1 62.11,28.24 C10.1
DP2
  Top 0.254: IC3.16 58.8,32.8 60,34 61.24,35.24 C12.1
  Top 0.305: R13.2 R9.1 62.11,35.24 C12.1
DP3  (via drill 0.5)
  Top 0.254: MOD2.14 v33,46 | v52,41 52.76,40.24 R23.1 C19.1
  Top 0.305: IC3.20 53.4,36.25 C19.1
  Bottom 0.254: v33,46 47,46 v52,41
GND  (via drill 0.5)
  Top 0.406: v37,21 v37,22 v36,22 v36,21 | v37,21 v36,21 | v36,21 v36,20 v37,20 v37,21 | J10.FIX3 6.59,24.59 J10.A12B1 | J10.FIX2 6.59,31.41 J10.A1B12
  Top 0.508: v37,21 C5.2 | VR2.2 39,17 39,19 38.1,19.9 | v37,22 38,22 38.1,21.9 C5.2 | 38.1,19.9 C5.2 | v37,20 38,20 38.1,19.9
  Top 2.54: 41.1,4 36,4 | 11.25,3.75 14,3.75 | 49.25,3.75 53.75,3.75
  other vias: 49,6 53,6 46,51 44,51 15,6 11,6 37,6 41,6 14.5,46.5 48,54 41,2.5 49,2.5 53,2.5 37,2.5 15,2.5 11,2.5 48,57 40,57 40,54 30,45.5 42,51 23,10 23,8 25,8 25,10 53.5,29 31,65 49.5,17.5 11,30.5 11,25
  pour Top (rank 2): 55.04,63.94 55.02,63.92 34.98,63.92 34.96,63.94 28.89,70 3,70 2.57,69.97 2.15,69.88 1.75,69.73 1.38,69.52 1.04,69.27 0.73,68.96 0.48,68.62 0.27,68.25 0.12,67.85 0.03,67.43 0,67 0,3 0.03,2.57 0.12,2.15 0.27,1.75 0.48,1.38 0.73,1.04 1.04,0.73 1.38,0.48 1.75,0.27 2.15,0.12 2.57,0.03 3,0 77,0 77.43,0.03 77.85,0.12 78.25,0.27 78.62,0.48 78.96,0.73 79.27,1.04 79.52,1.38 79.73,1.75 79.88,2.15 79.97,2.57 80,3 80,67 79.97,67.43 79.88,67.85 79.73,68.25 79.52,68.62 79.27,68.96 78.96,69.27 78.62,69.52 78.25,69.73 77.85,69.88 77.43,69.97 77,70 61.03,69.92
  pour Bottom: 55.04,63.94 55.02,63.92 34.98,63.92 34.96,63.94 28.89,70 3,70 2.57,69.97 2.15,69.88 1.75,69.73 1.38,69.52 1.04,69.27 0.73,68.96 0.48,68.62 0.27,68.25 0.12,67.85 0.03,67.43 0,67 0,3 0.03,2.57 0.12,2.15 0.27,1.75 0.48,1.38 0.73,1.04 1.04,0.73 1.38,0.48 1.75,0.27 2.15,0.12 2.57,0.03 3,0 77,0 77.43,0.03 77.85,0.12 78.25,0.27 78.62,0.48 78.96,0.73 79.27,1.04 79.52,1.38 79.73,1.75 79.88,2.15 79.97,2.57 80,3 80,67 79.97,67.43 79.88,67.85 79.73,68.25 79.52,68.62 79.27,68.96 78.96,69.27 78.62,69.52 78.25,69.73 77.85,69.88 77.43,69.97 77,70 61.03,69.92
  pour Route15: 55.04,63.94 55.02,63.92 34.98,63.92 34.96,63.94 28.97,69.92 3,70 2.57,69.97 2.15,69.88 1.75,69.73 1.38,69.52 1.04,69.27 0.73,68.96 0.48,68.62 0.27,68.25 0.12,67.85 0.03,67.43 0,67 0,3 0.03,2.57 0.12,2.15 0.27,1.75 0.48,1.38 0.73,1.04 1.04,0.73 1.38,0.48 1.75,0.27 2.15,0.12 2.57,0.03 3,0 77,0 77.43,0.03 77.85,0.12 78.25,0.27 78.62,0.48 78.96,0.73 79.27,1.04 79.52,1.38 79.73,1.75 79.88,2.15 79.97,2.57 80,3 80,67 79.97,67.43 79.88,67.85 79.73,68.25 79.52,68.62 79.27,68.96 78.96,69.27 78.62,69.52 78.25,69.73 77.85,69.88 77.43,69.97 77,70 61.11,70
IO0_LED  (via drill 0.5)
  Top 0.254: R17.2 59.95,53.29 | 59.95,53.29 S2.2 | 59.95,53.29 57.5,50.84 57.5,50 57.5,47 57,46.5 56.49,45.99 MOD2.27 52.01,45.99 51,47 v51,48 | LED2.4 27.55,36 30,36 v31,36
  Bottom 0.254: v31,36 54,36 55,36 57,38 57,42 55,44 v51,48
IO1_TX
  Top 0.254: J1.1 70.19,58.81 69,60 67.77,61.23 MOD2.39
IO2_RX
  Top 0.254: J1.2 71,55 67,59 66.04,59.96 MOD2.38
IO4_SCL  (via drill 0.5)
  Top 0.254: J4.4 24.5,60.5 26,59 26,57 27,56 31,56 31.76,56.76 R24.2 33,58 33.69,58.69 MOD2.4 38.19,58.69 v38.5,59
  Bottom 0.254: MOD1.SCL 58.27,43.73 57,45 56,46 56,56 53,59 51,59 v38.5,59
IO5_SDA  (via drill 0.5)
  Top 0.254: J4.3 24,59.5 24.5,59 25,58.5 25,56.5 26.5,55 27,54.5 30.5,54.5 v31.5,54.5 34,57 34.42,57.42 MOD2.5 | MOD1.SDA 58.31,41.19 57,42.5 50.5,42.5 v48.5,40.5 | R18.2 v37.5,42
  Bottom 0.254: v31.5,54.5 31.5,44.5 34,42 v37.5,42 47,42 v48.5,40.5
IO14_A4_PIEZO
  Top 0.254: MOD2.22 47,44.52 47,42 39.72,34.72 SPKR2.1
IO16_CANTX
  Top 0.254: MOD2.9 31.84,52.34 26.34,52.34 25,51 25,47.5 25,46.5 25,46 25.91,45.09 IC2.1
IO17_CANRX
  Top 0.254: MOD2.10 33,51.07 30.84,48.91 IC2.4
N$1
  Top 0.254: R4.2 44.76,31 45.5,31 47,31 47.2,31.2 IC3.27
N$2
  Top 0.305: R5.2 41.65,26.59 IC4.3
N$3
  Top 0.305: C9.1 30,4.24 L1.1
  Top 0.813: VR1.8 27.08,7.2 L1.1
N$4
  Top 0.406: R19.2 21.93,43 21.03,43.9 IC2.8
N$5
  Top 0.508: J7.VBUS 63.69,10.51 63.5,10.7 F1.2
N$6
  Top 0.406: J6.VBUS 69.51,32.51 | 65.05,41.4 65.04,41.46 F2.2
  Top 0.508: 69.51,32.51 72,35 72,38 72,39 70,41 68,41 67.6,41.4 65.05,41.4
N$7
  Top 0.254: J10.B5 4.25,26.25 4,26 3.24,25.24 R2.2
N$8  (via drill 0.5)
  Top 0.254: R25.2 55.24,17.56 v56.4,16.4
  Bottom 0.254: v56.4,16.4 LED3.A
N$9
  Top 0.406: J2.1 12.23,42 11,42 10.5,41.5 R1.1
N$12
  Top 0.254: R10.2 3.24,30.76 4,30 4.75,29.25 J10.A5
N$13
  Top 0.305: R15.2 22.09,13.67 VR1.4
N$14
  Top 0.254: R13.1 66.24,37 J6.D+
N$15
  Top 0.254: R14.1 66.53,32.24 J6.D-
N$16
  Top 0.254: R28.1 66.24,29.76 67,29 67,24 67,17.29 J7.D+
N$17
  Top 0.254: R27.1 66,16.29 J7.D-
N$18
  Top 0.305: R11.2 R16.1 20.36,7.76 VR1.5
N$19
  Top 0.305: C9.2 25,4 24.64,4.37 VR1.7
N$20
  pour Top: 40.5,17.5 42.5,17.5 42.5,21.5 40.5,21.5
N$22  (via drill 0.5)
  Top 0.406: J10.A4B9 6.64,30.5 v8,30.5 | v8,25.5 6.64,25.5 J10.A9B4
  Top 0.61: v8,25.5 10.2,23.3 12.8,23.3 14,24.5 F4.1
  Bottom 0.406: v8,30.5 v8,25.5
N$23
  Top 0.254: LED1.A R8.1
N$24
  Top 0.61: D3.A 16.5,28.35 15.35,29.5 F4.2
N$25
  Top 0.254: LED2.2 21.07,37.5 D4.1
N$27
  Top 0.254: LED2.3 24.1,35.9 25.5,34.5 25.5,33.5 25.5,30 24.5,29 J8.2
USB_N  (via drill 0.5)
  Top 0.254: J10.A7 7.75,27.75 8,28 | J10.B7 7.25,28.75 7.75,28.75 8,28.5 8,28 | 8,28 9.5,28 10,28 v11,29 | R21.1 v51,17.5
  Bottom 0.254: v51,17.5 51,19.15 46.82,23.32 45.69,24.46 39,24.46 20.54,24.46 20,25 17.04,27.96 14,27.96 13.73,28.22 12.62,28.22 11.84,29 v11,29
USB_P  (via drill 0.5)
  Top 0.254: J10.A6 5.25,28.25 5,28 5,27.5 5.25,27.25 J10.B6 10.25,27.25 v11,26.5 | R22.1 v48,17.5
  Bottom 0.254: v48,17.5 48,21.5 46.5,23 45.5,24 39,24 20.35,24 19.68,24.68 16.85,27.5 14,27.5 13.09,27.5 12.83,27.77 12.28,27.77 12.13,27.62 12.13,27.63 v11,26.5
VIN+
  Top 0.813: C27.1 C17.1 | C17.1 C2.1 24,14.9 24,11.97 | C7.+ 13,14.85 D1.C C17.1 | VR1.2 24,11.97 | 24,11.97 VR1.3
VRAW
  Bottom 0.813: J5.1 2.9,11.1 2,12 2,16 2,19.9 3.5,21.4 3.5,24.5 3.5,31 3.5,35.5 3,36 2,37 2,41 2,52 4,54 8.5,54 15,54 21.9,54 22.75,54.85 F5.2 F5.1

### Text on the board
tPlace: Qwiic | RESET | Kayo | SCL | SDA | GND | Txo | 3.3V | SNOOT | 1A FUSE | Rxi | GND | CAN BUS | USB1 | CAN / TERM | OpenKayo | by Jon Oxer | WS2813B | 5V | LED | GND | USB2 | 12Vdc | SKU: OPENKAYO | v1.1
bPlace: L | H | (C)2023 SuperHouse Automation Pty Ltd | www.superhouse.tv/openkayo | Made in / Australia | IO0: LED / IO1: KAYO_TXo / IO2: KAYO_RXi / IO4: SCL / IO5: SDA / IO14: PIEZO / IO16: CAN_TX / IO17: CAN_RX